# EasyEDA Pro project use0.1.eprj

# Schematic Schematic1
Board Name: Board1; Create Date: 2024-12-07; Page Name: P1; Project Name: use0.1; Schematic Name: Schematic1; Update Date: 2025-06-07; Add into BOM: yes; Company: 嘉立创EDA; Convert to PCB: yes; Page Size: A4; Version: V1.0
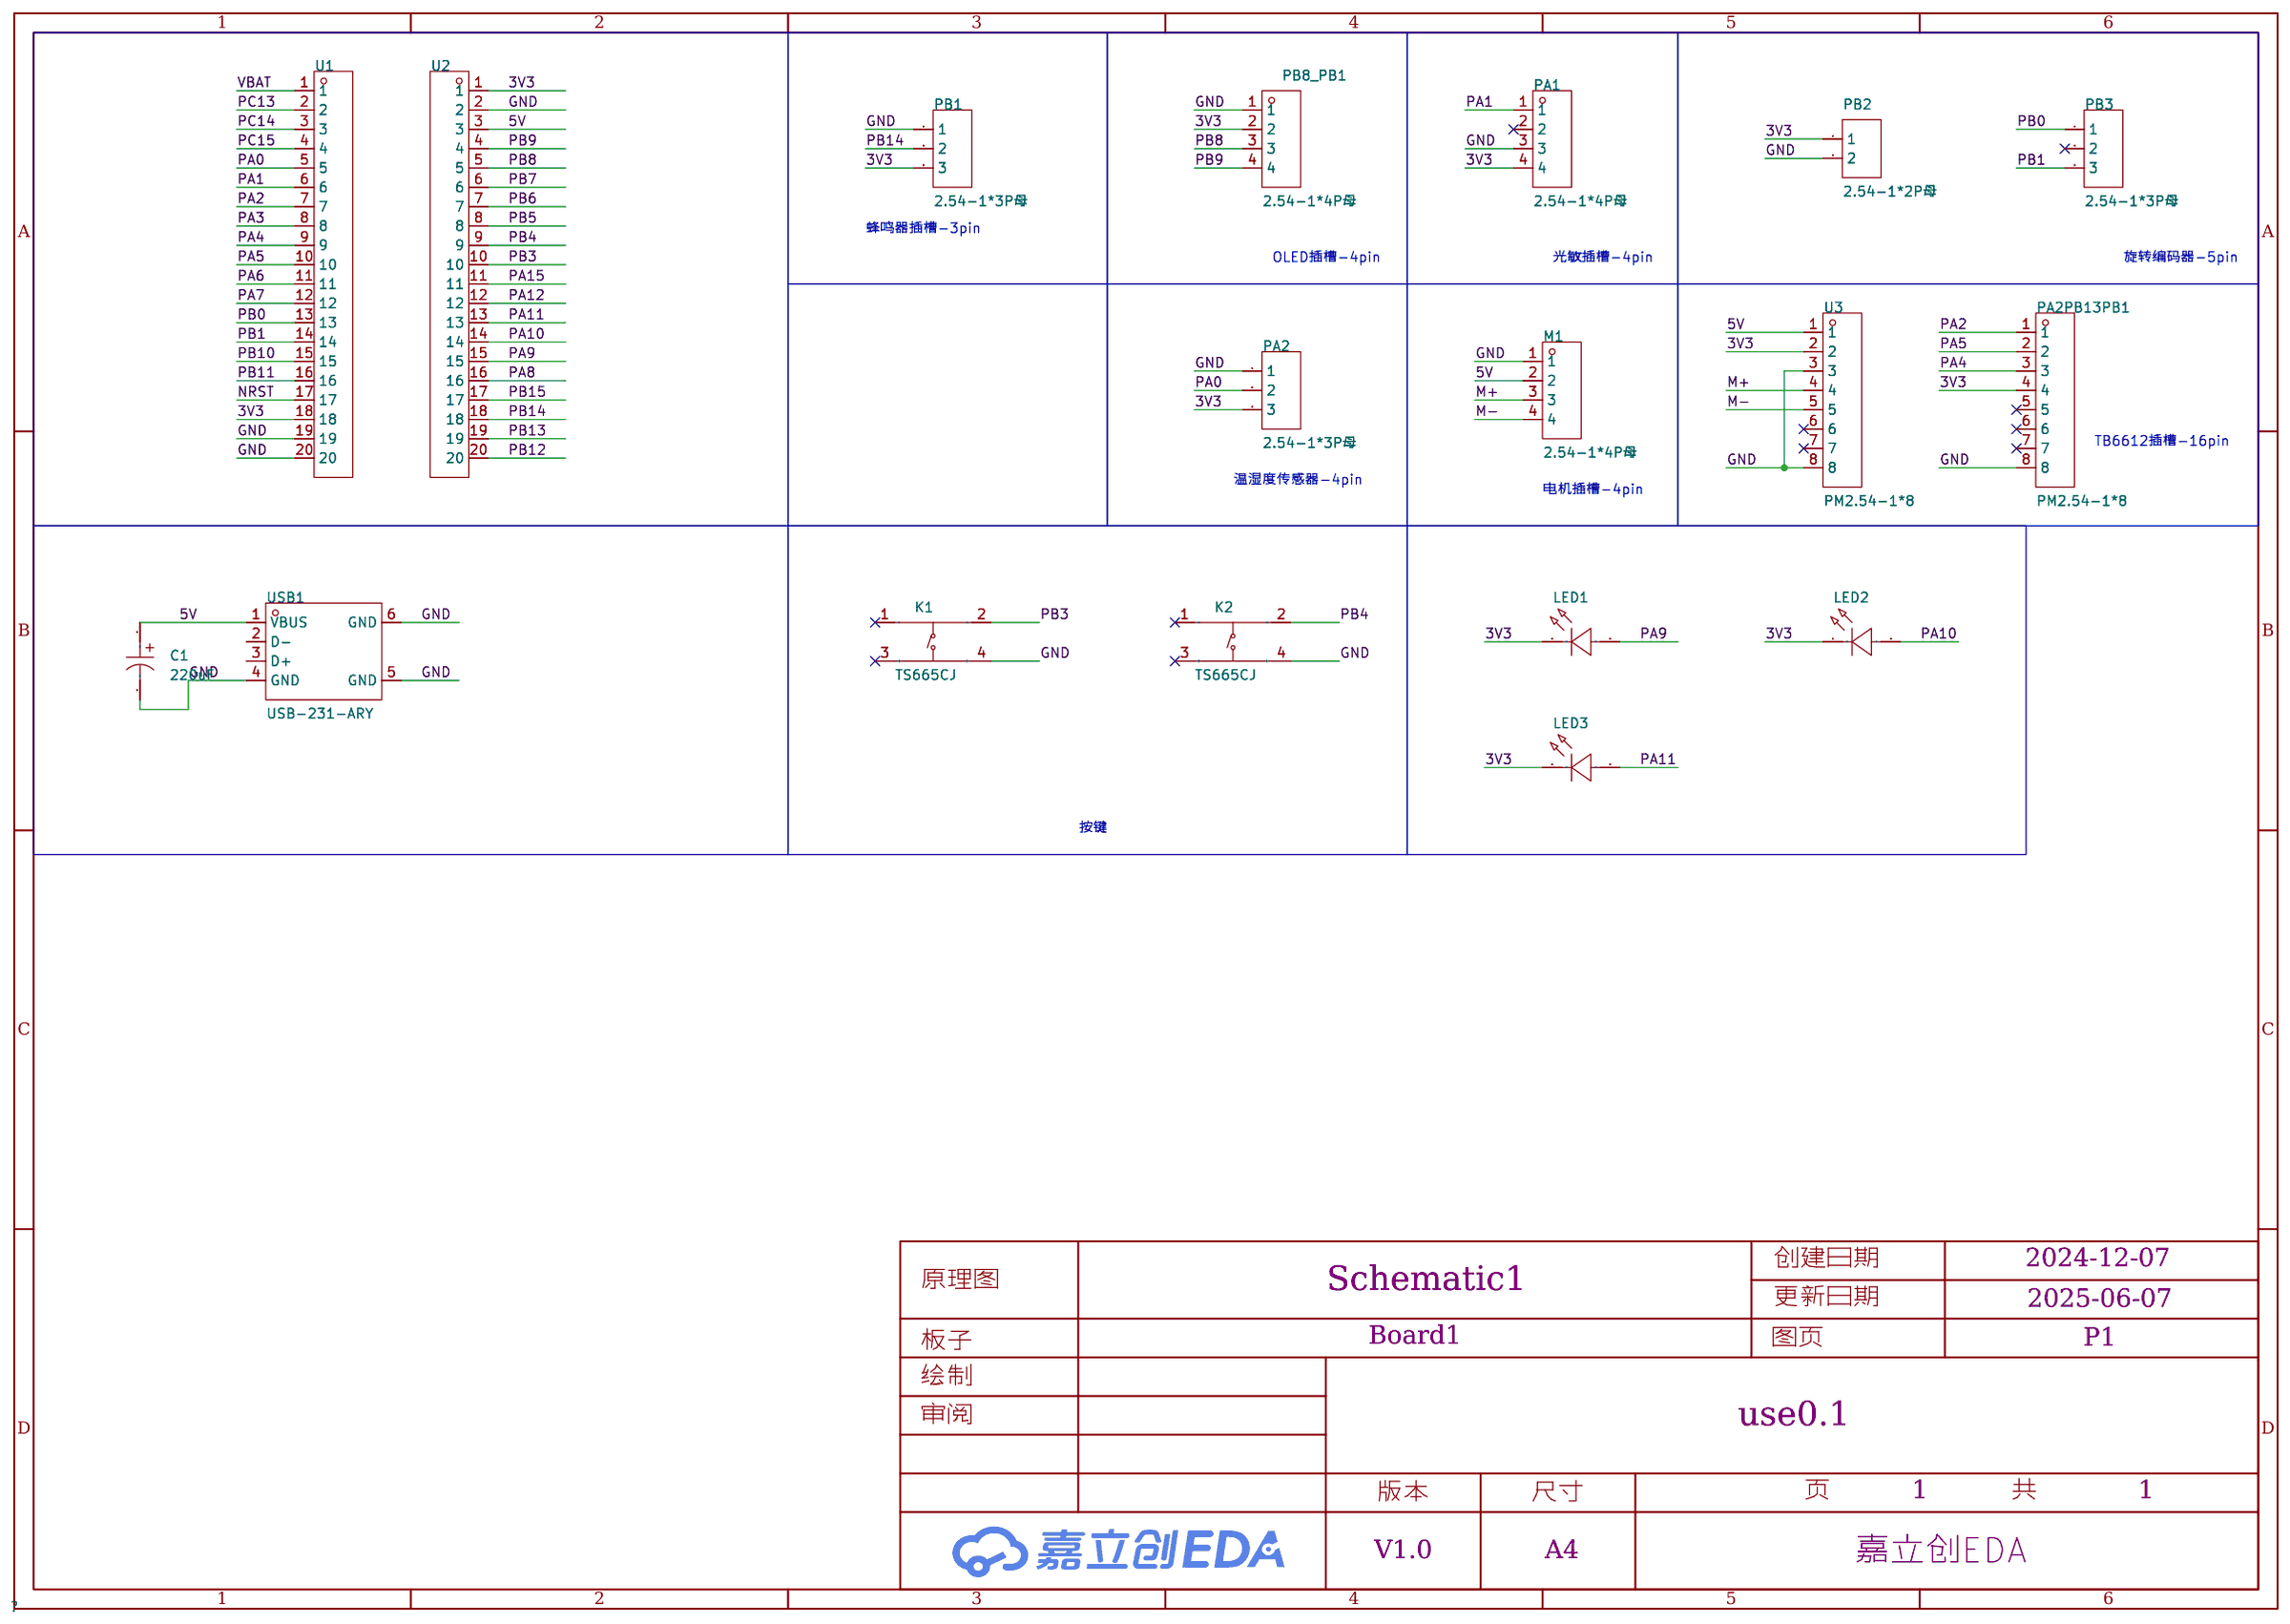
[diagram p0: schematic sheet]

## Parts
C1  220uF  [CAP-TH_BD5.0-P2.00-D0.5-FD]
K1  TS665CJ  [SW-TH_4P-L6.0-W6.0-P4.50-LS6.5]
K2  TS665CJ  [SW-TH_4P-L6.0-W6.0-P4.50-LS6.5]
LED1  NFD5408BC  [LED-TH_BD5.7-P2.54-RD]
LED2  NFD5408BC  [LED-TH_BD5.7-P2.54-RD]
LED3  NFD5408BC  [LED-TH_BD5.7-P2.54-RD]
M1  2.54-1*4P母  [HDR-TH_4P-P2.54-V-F]
PA1  2.54-1*4P母  [HDR-TH_4P-P2.54-V-F]
PA2  2.54-1*3P母  [HDR-TH_3P-P2.54-V-F]
PA2PB13PB1  PM2.54-1*8  [HDR-TH_8P-P2.54-V-F]
PB1  2.54-1*3P母  [HDR-TH_3P-P2.54-V-F]
PB2  2.54-1*2P母  [HDR-TH_2P-P2.54-V-F]
PB3  2.54-1*3P母  [HDR-TH_3P-P2.54-V-F]
PB8_PB1  2.54-1*4P母  [HDR-TH_4P-P2.54-V-F]
U1  KH-2.54FH-1X20P-H8.5  [HDR-TH_20P-P2.54-V-F-2]
U2  KH-2.54FH-1X20P-H8.5  [HDR-TH_20P-P2.54-V-F-2]
U3  PM2.54-1*8  [HDR-TH_8P-P2.54-V-F]
USB1  USB-231-ARY  [USB-A-TH_USB-231-ARY]

## Library data of the parts
C1 = ERA10V220M5X11: LCSC Part Name: 220uF ±20% 10V; Supplier Part: C49256786; Manufacturer: JIERR(捷而瑞); Supplier Footprint: 插件,D5xL11mm; JLCPCB Part Class: 扩展库; Datasheet: https://item.szlcsc.com/datasheet/ERA10V220M5X11/51692186.html; Supplier: LCSC; Tolerance: ±20%; Voltage Rating: 10V; Ripple Current: 170mA@120Hz; Pin Spacing: 2mm; Diameter: 5mm; Height - Seated (Max): 11mm; Lifetime: 2000hrs@105℃; Operating Temperature: -40℃~+105℃
K1 K2 = TS665CJ: 电路结构:单刀单掷;按钮形状:圆形按钮;安装方式:直插;开关长度:6mm;开关宽度:6mm;开关高度:5mm;触点电流:50mA;额定电压(DC):12V;带灯:-;机械寿命:-;; LCSC Part Name: 6*6*5mm 直插 轻触开关; Supplier Part: C393938; Manufacturer: SHOU HAN(首韩); Supplier Footprint: 插件; JLCPCB Part Class: 扩展库; Datasheet: https://atta.szlcsc.com/upload/public/pdf/source/20190521/C393938_BDABEAC600B4C55E200A80AA129B70BC.pdf; Supplier: LCSC; Circuit: 单刀单掷; Actuator Style: 圆形按钮; Mounting Style: 直插; Switch Length: 6mm; Switch Width: 6mm; Switch Height: 5mm; Contact Current: 50mA; Voltage Rating (DC): 12V
LED1-LED3 = NFD5408BC: LCSC Part Name: 发光二极管/LED; Supplier Part: C20618158; Manufacturer: 国星光电; Supplier Footprint: 插件,D=5mm; JLCPCB Part Class: 扩展库; Datasheet: https://atta.szlcsc.com/upload/public/pdf/source/20240202/FDA91858A41DA632758C1664CA47056B.pdf; Supplier: LCSC; Emitted Color: 蓝色; Power Dissipation: 200mW; Dominant Wavelength: 460nm~470nm; Viewing Angle: 20°; Operating Temperature: -30℃~+85℃
M1 PA1 PB8_PB1 = 2.54-1*4P母: 插孔结构:1x4P;间距:2.54mm;行距:-;圆孔/方孔:方孔;安装类型:直插;排数:单排;总孔位数:4P;额定电流:3A;额定电压:-;插孔方向:顶部;塑高:-;触头材质:青铜;触头镀层:-;工作温度范围:-40℃~+105℃;焊接温度(最大值):-;; LCSC Part Name: 间距:2.54mm 1x4P 直插; Supplier Part: C2718488; Manufacturer: BOOMELE(博穆精密); Supplier Footprint: 插件,P=2.54mm; JLCPCB Part Class: 扩展库; Datasheet: https://atta.szlcsc.com/upload/public/pdf/source/20210301/C2718488_F4427B881E42CAA8DDB0B1C12B3A522C.pdf; Supplier: LCSC; Holes Structure: 1x4P; Pitch: 2.54mm; Circular Hole / Square Hole: 方孔; Mounting Type: 直插; Number of Rows: 单排; Number of Holes: 4P; Current Rating (Max): 3A; Holes Direction: 顶部; Contact Material: 青铜; Operating Temperature Range: -40℃~+105℃
PA2 PB1 PB3 = 2.54-1*3P母: 间距:2.54mm;行距:-;安装类型:直插;排数:单排;总孔位数:3P;塑高:-;触头材质:-;触头镀层:金;; LCSC Part Name: 间距:2.54mm 直插; Supplier Part: C146243; Manufacturer: BOOMELE(博穆精密); Supplier Footprint: 插件,P=2.54mm; JLCPCB Part Class: 扩展库; Supplier: LCSC; Pitch: 2.54mm; Mounting Type: 直插; Number of Rows: 单排; Number of Holes: 3P; Contact Plating: 金
PA2PB13PB1 U3 = PM2.54-1*8: 插孔结构:1x8P;间距:2.54mm;行距:2.54mm;圆孔/方孔:方孔;安装类型:直插;排数:单排;总孔位数:8P;额定电流:2.5A;插孔方向:顶部;塑高:8.5mm;工作温度范围:-40℃~+105℃;; LCSC Part Name: 间距:2.54mm 1x8P 直插; Supplier Part: C5224027; Manufacturer: ZHOURI(洲日); Supplier Footprint: 插件,P=2.54mm; JLCPCB Part Class: 扩展库; Datasheet: https://atta.szlcsc.com/upload/public/pdf/source/20221031/E5BAE727A502DC7C69CE947E807E2296.pdf; Supplier: LCSC; Holes Structure: 1x8P; Pitch: 2.54mm; Row Spacing: 2.54mm; Circular Hole / Square Hole: 方孔; Mounting Type: 直插; Number of Rows: 单排; Number of Holes: 8P; Current Rating (Max): 2.5A; Holes Direction: 顶部; Insulation Height: 8.5mm; Operating Temperature Range: -40℃~+105℃
PB2 = 2.54-1*2P母: 插孔结构:1x2P;间距:2.54mm;行距:-;安装类型:直插;排数:单排;总孔位数:2P;塑高:-;触头材质:-;触头镀层:-;; LCSC Part Name: 间距:2.54mm 1x2P 直插; Supplier Part: C49661; Manufacturer: BOOMELE(博穆精密); Supplier Footprint: 插件,P=2.54mm; JLCPCB Part Class: 扩展库; Datasheet: https://atta.szlcsc.com/upload/public/pdf/source/20210301/C2718488_F4427B881E42CAA8DDB0B1C12B3A522C.pdf; Supplier: LCSC; Holes Structure: 1x2P; Pitch: 2.54mm; Mounting Type: 直插; Number of Rows: 单排; Number of Holes: 2P
U1 U2 = KH-2.54FH-1X20P-H8.5: 插孔结构:1x20P;间距:2.54mm;行距:-;圆孔/方孔:方孔;安装类型:直插;排数:单排;总孔位数:20P;额定电流:3A;额定电压:-;插孔方向:顶部;塑高:8.5mm;工作温度范围:-40℃~+105℃;; LCSC Part Name: 间距:2.54mm 1x20P 直插; Supplier Part: C2905423; Manufacturer: kinghelm(金航标); Supplier Footprint: 插件,P=2.54mm; JLCPCB Part Class: 扩展库; Datasheet: https://atta.szlcsc.com/upload/public/pdf/source/20211019/BDB673907948473CE61C8A1CF06C5BF5.pdf; Supplier: LCSC; Holes Structure: 1x20P; Pitch: 2.54mm; Circular Hole / Square Hole: 方孔; Mounting Type: 直插; Number of Rows: 单排; Number of Holes: 20P; Current Rating (Max): 3A; Holes Direction: 顶部; Insulation Height: 8.5mm; Operating Temperature Range: -40℃~+105℃
USB1 = USB-231-ARY: 连接器类型:Type-A;标准:USB 2.0;公母:母;端口数量:1;触点数量:4P;安装方式:弯插;额定电流 - 电源:1.5A;触头材质:-;触头镀层:-;工作温度范围:-20℃~+70℃;焊接温度(最大值):260℃;; LCSC Part Name: Type-A 母 弯插; Supplier Part: C720525; Manufacturer: XUNPU(讯普); Supplier Footprint: 插件; JLCPCB Part Class: 扩展库; Datasheet: https://atta.szlcsc.com/upload/public/pdf/source/20200810/C720525_A4C9C15D608FF9239C9C137FD959DB52.pdf; Supplier: LCSC; Connector Type: Type-A; Standard: USB 2.0; Gender: 母; Number of Ports: 1; Number of Contacts: 4P; Mounting Style: 弯插; Current Rating - Power (Max): 1.5A; Operating Temperature Range: -20℃~+70℃; Soldering Temperature(Max): 260℃

## Nets
3V3: LED1.1(K) LED2.1(K) LED3.1(K) PA1.4 PA2.3 PA2PB13PB1.4 PB1.3 PB2.1 PB8_PB1.2 U1.18 U2.1 U3.2
5V: C1.1 M1.2 U2.3 U3.1 USB1.1(VBUS)
GND: C1.2 K1.4(D) K2.4(D) M1.1 PA1.3 PA2.1 PA2PB13PB1.8 PB1.1 PB2.2 PB8_PB1.1 U1.19 U1.20 U2.2 U3.3 U3.8 USB1.4(GND) USB1.5(GND) USB1.6(GND)
VBAT: U1.1
M+: M1.3 U3.4
M-: M1.4 U3.5
NRST: U1.17
PA0: PA2.2 U1.5
PA1: PA1.1 U1.6
PA2: PA2PB13PB1.1 U1.7
PA3: U1.8
PA4: PA2PB13PB1.3 U1.9
PA5: PA2PB13PB1.2 U1.10
PA6: U1.11
PA7: U1.12
PA8: U2.16
PA9: LED1.2(A) U2.15
PA10: LED2.2(A) U2.14
PA11: LED3.2(A) U2.13
PA12: U2.12
PA15: U2.11
PB0: PB3.1 U1.13
PB1: PB3.3 U1.14
PB3: K1.2(B) U2.10
PB4: K2.2(B) U2.9
PB5: U2.8
PB6: U2.7
PB7: U2.6
PB8: PB8_PB1.3 U2.5
PB9: PB8_PB1.4 U2.4
PB10: U1.15
PB11: U1.16
PB12: U2.20
PB13: U2.19
PB14: PB1.2 U2.18
PB15: U2.17
PC13: U1.2
PC14: U1.3
PC15: U1.4

Not connected (* = marked no-connect by the designer): K1 1(A)* 3(C)*; K2 1(A)* 3(C)*; PA1 2*; PA2PB13PB1 5* 6* 7*; PB3 2*; U3 6* 7*; USB1 2(D-) 3(D+)

## Notes on the sheet
- 蜂鸣器插槽-3pin
- OLED插槽-4pin
- 光敏插槽-4pin
- 旋转编码器-5pin
- TB6612插槽-16pin
- 温湿度传感器-4pin
- 电机插槽-4pin
- 按键

# Board PCB2
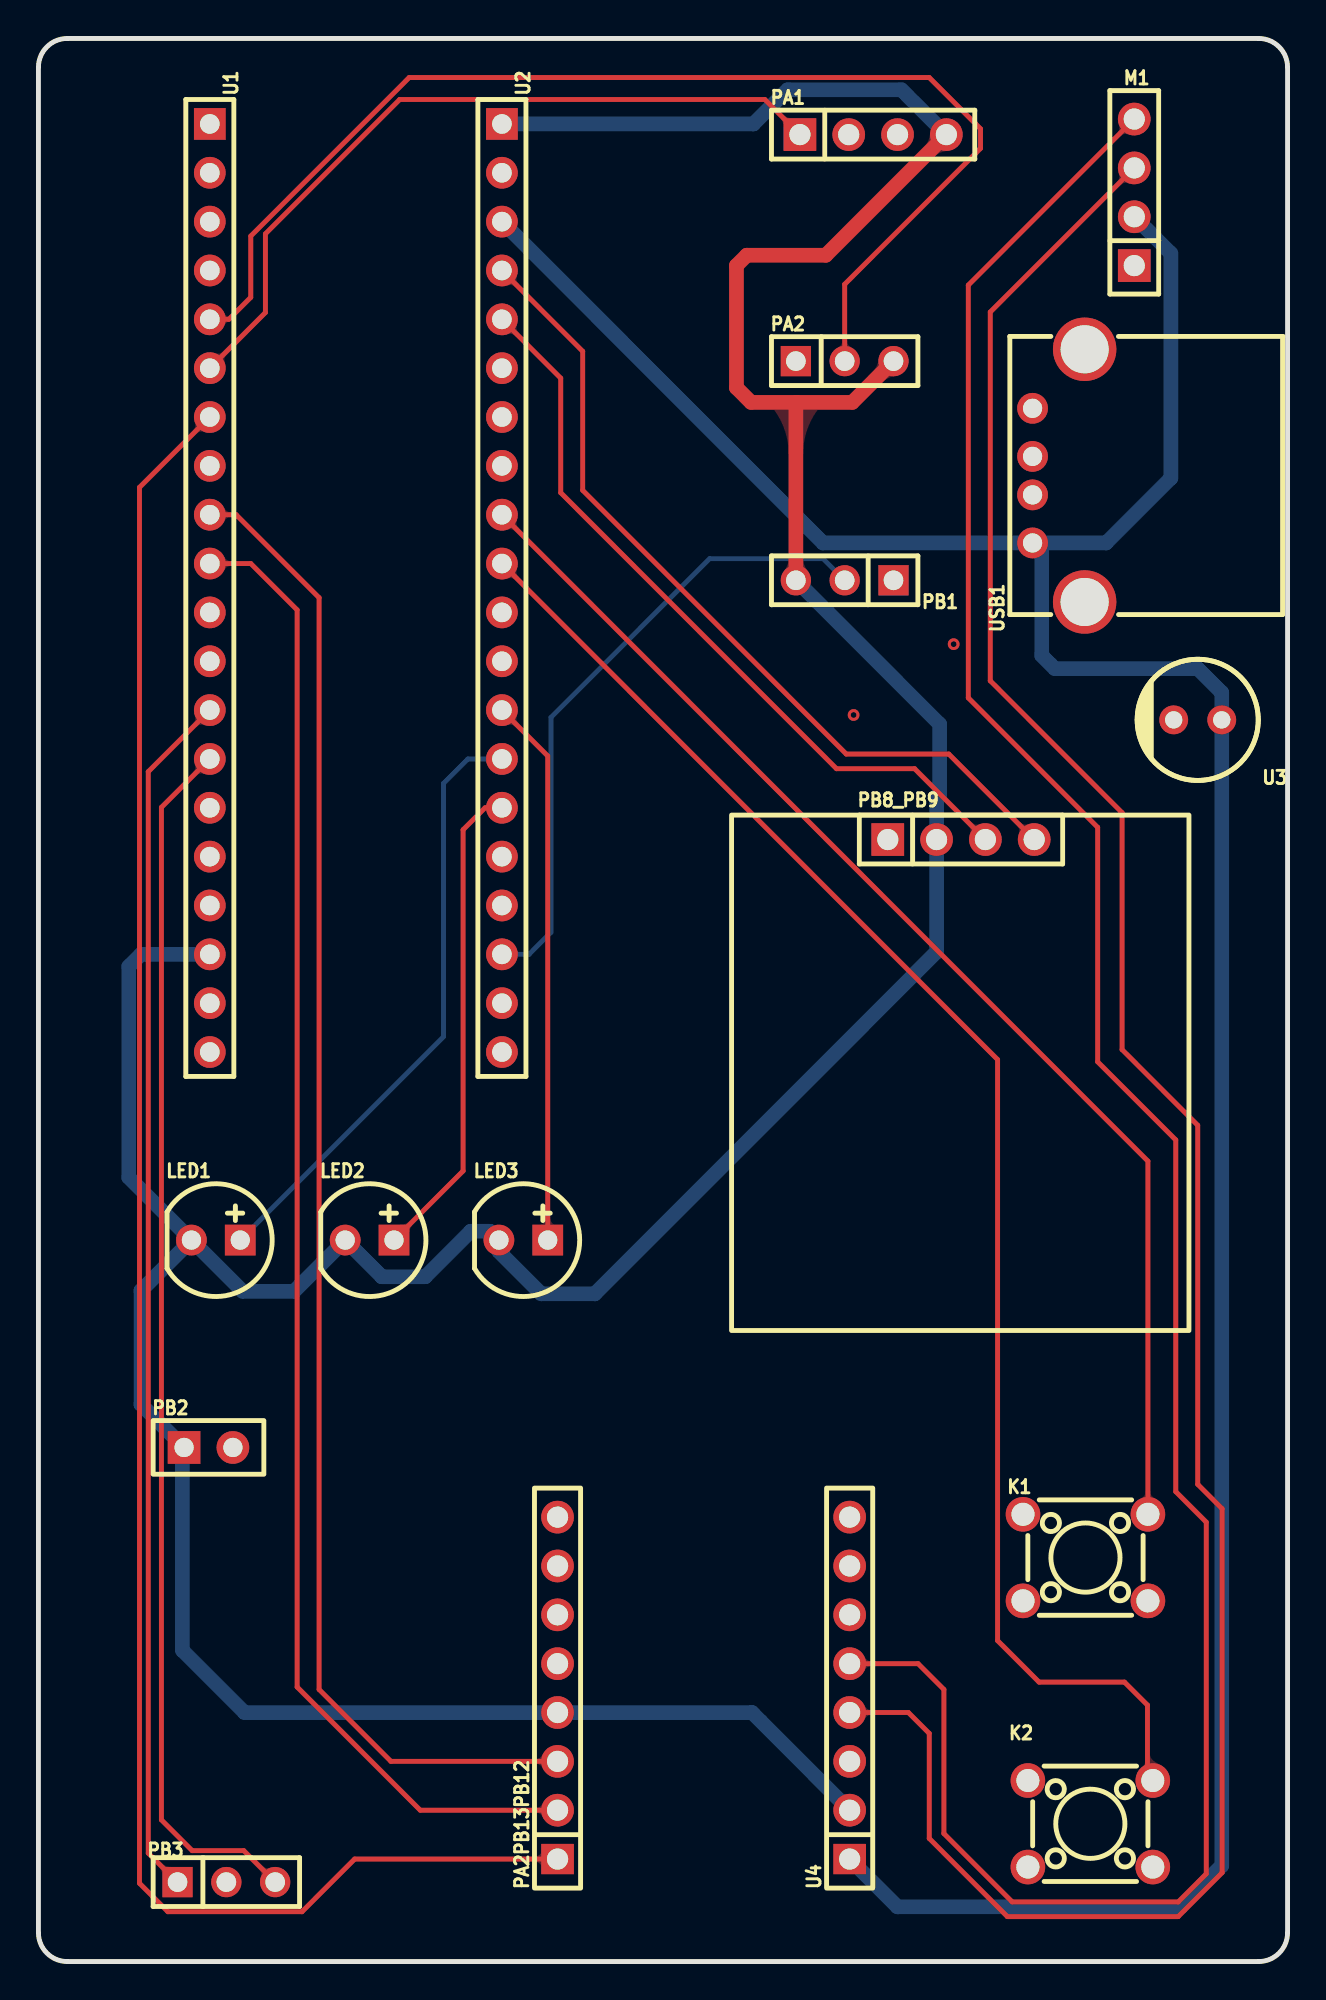
[diagram p1: board, top side]
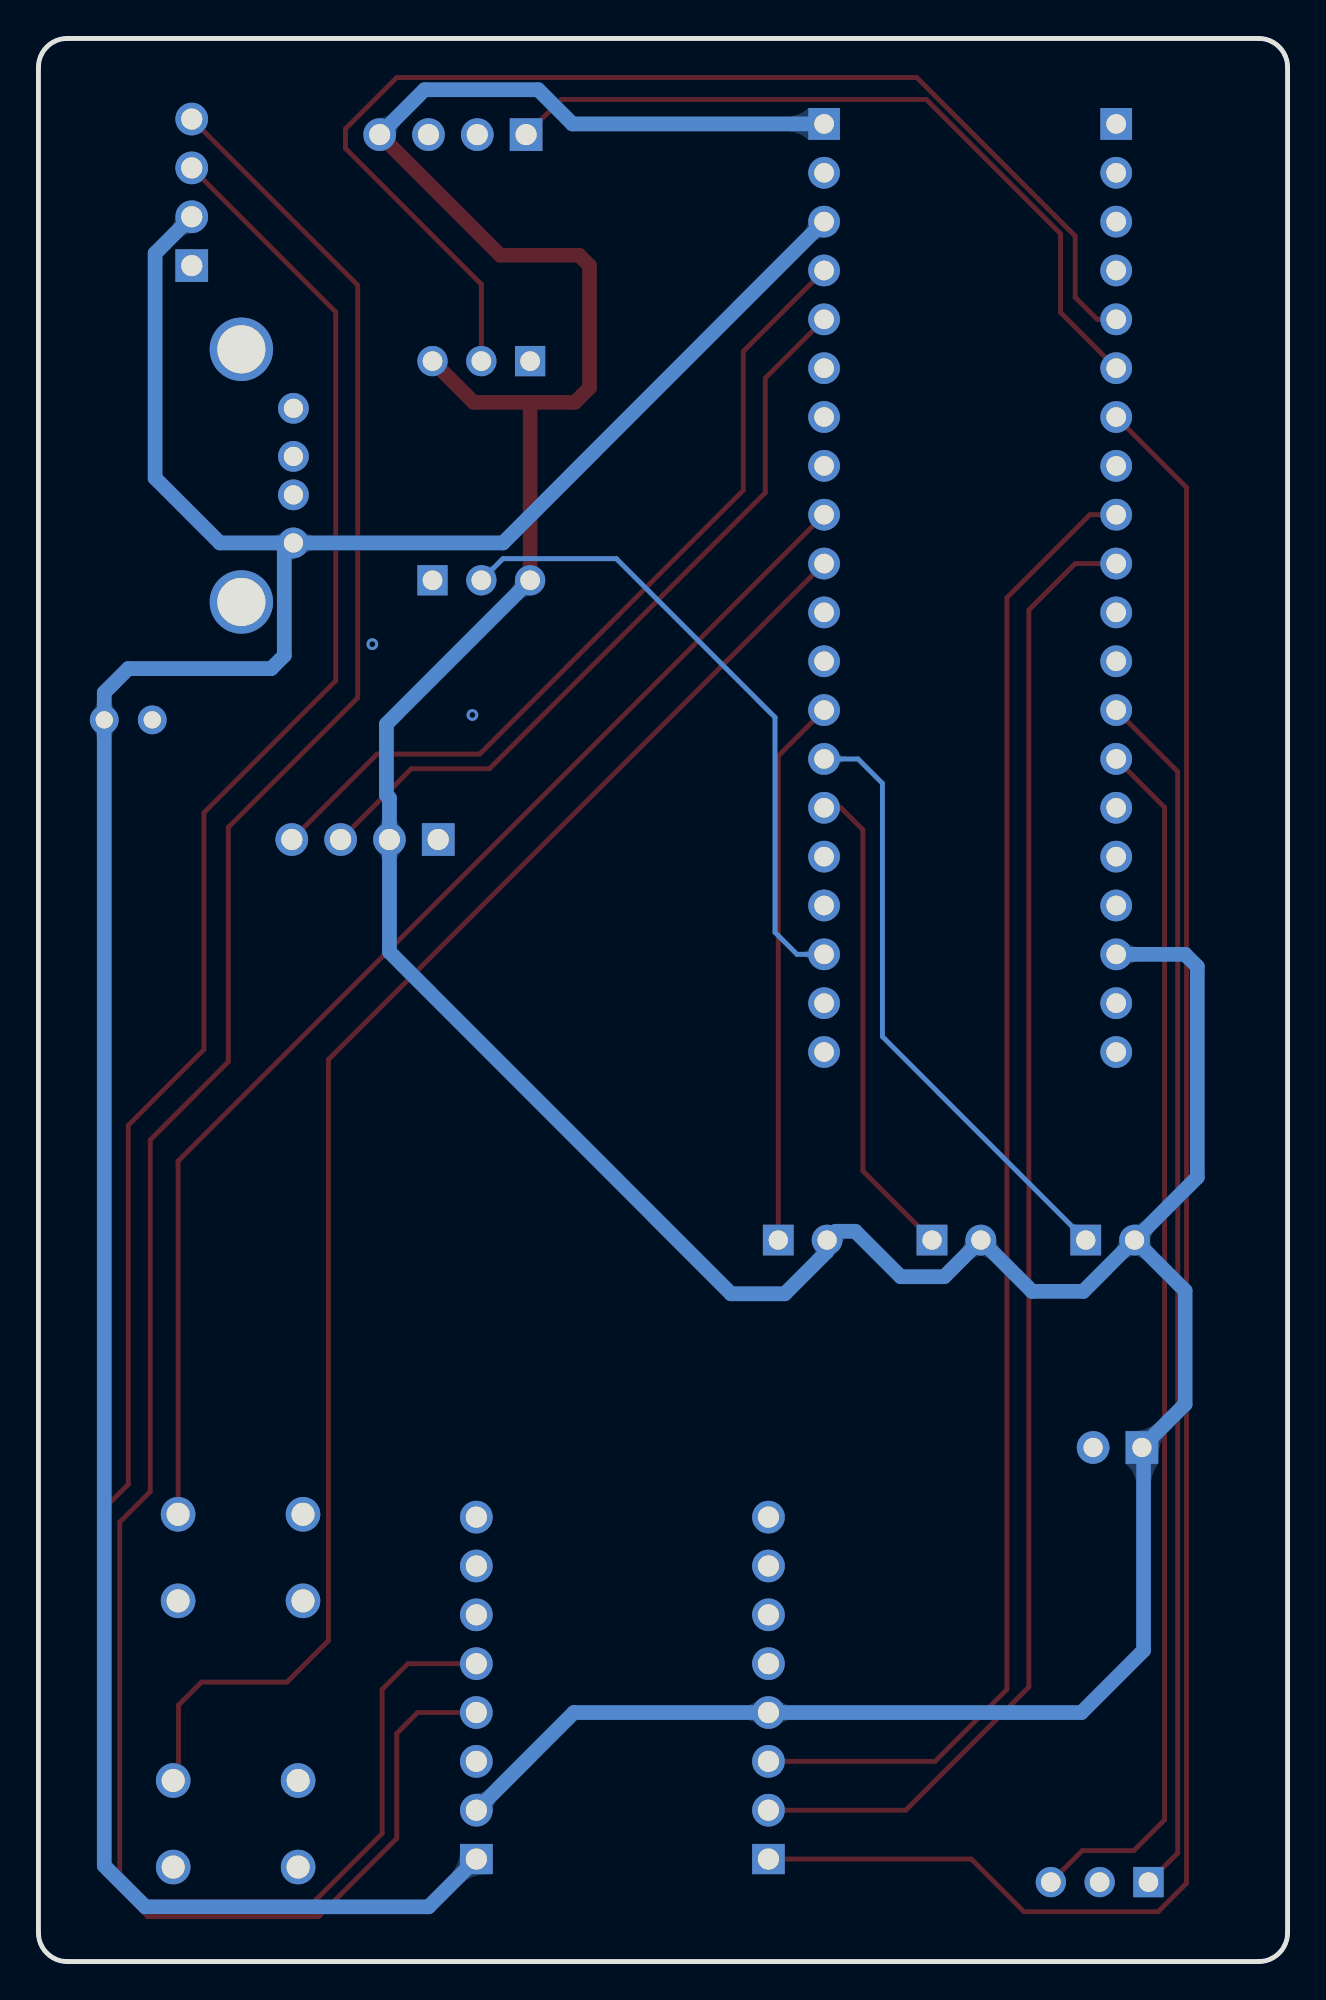
[diagram p2: board, bottom side, seen from below]

Outline 65 x 100 mm; copper layers: Top Layer, Bottom Layer. Coordinates in mm from the lower left corner of the outline.
Outline path: 0,98.5 0,1.5 arc(0.44,0.44) 1.5,0 63.5,0 arc(64.56,0.44) 65,1.5 65,98.5 arc(64.56,99.56) 63.5,100 1.5,100 arc(0.44,99.56) 0,98.5
Stack: Top Layer 0.035mm / Dielectric1 1.51mm FR4 er 4.5 / Bottom Layer 0.035mm

## Design rules (mm)
template: my pcb
spacing copperThickness1oz (default): track to track 0.203, other pairs 0.203 to 0.203
track width copperThickness1oz (default): min 0.254, default 0.254, max 0.762
track width VCC and  GND: min 0.254, default 0.762, max 0.762
differential pair differentialPair (default): width min 0.127, default 0.254, max 2.54; gap min 0.152, default 0.152
via viaSize (default): diameter min 0.5, default 0.61, max 10; hole min 0.3, default 0.305, max 6.299
net GND uses VCC and  GND
net 3V3 uses VCC and  GND
net 5V uses VCC and  GND

## Placement (name value [footprint] x y rotation side)
K1  TS665CJ  [SW-TH_4P-L6.0-W6.0-P4.50-LS6.5]  54.48 21.01 0 top
K2  TS665CJ  [SW-TH_4P-L6.0-W6.0-P4.50-LS6.5]  54.74 7.16 0 top
LED1  NFD5408BC  [LED-TH_BD5.7-P2.54-RD]  9.23 37.52 0 top
LED2  NFD5408BC  [LED-TH_BD5.7-P2.54-RD]  17.23 37.52 0 top
LED3  NFD5408BC  [LED-TH_BD5.7-P2.54-RD]  25.23 37.52 0 top
M1  2.54-1*4P母  [HDR-TH_4P-P2.54-V-F]  57.02 92 90 top
PA1  2.54-1*4P母  [HDR-TH_4P-P2.54-V-F]  43.43 95 0 top
PA2  2.54-1*3P母  [HDR-TH_3P-P2.54-V-F]  41.95 83.22 0 top
PA2PB13PB12  PM2.54-1*8  [HDR-TH_8P-P2.54-V-F]  27.01 14.22 90 top
PB1  2.54-1*3P母  [HDR-TH_3P-P2.54-V-F]  41.95 71.83 180 top
PB2  2.54-1*2P母  [HDR-TH_2P-P2.54-V-F]  8.85 26.73 0 top
PB3  2.54-1*3P母  [HDR-TH_3P-P2.54-V-F]  9.78 4.13 0 top
PB8_PB9  2.54-1*4P母  [HDR-TH_4P-P2.54-V-F]  48.01 58.34 0 top
U1  KH-2.54FH-1X20P-H8.5  [HDR-TH_20P-P2.54-V-F-2]  8.92 71.42 270 top
U2  KH-2.54FH-1X20P-H8.5  [HDR-TH_20P-P2.54-V-F-2]  24.12 71.42 270 top
U3  PM2.54-1*8  [CAP-TH_BD6.3-P2.50-D0.5-FD]  60.32 64.57 180 top
U4  PM2.54-1*8  [HDR-TH_8P-P2.54-V-F]  42.21 14.22 90 top
USB1  USB-231-ARY  [USB-A-TH_USB-231-ARY]  53.09 77.27 90 top

## Footprints (pads in the part's own frame, mm; a bottom-side part is the same pattern mirrored in y, then rotated)
CAP-TH_BD6.3-P2.50-D0.5-FD
  round 1.5 hole 0.9: 1(-1.25,0) 2(1.25,0)
HDR-TH_2P-P2.54-V-F
  rect 1.7x1.7 hole 1: 1(-1.27,0)
  round 1.7 hole 1: 2(1.27,0)
HDR-TH_3P-P2.54-V-F
  rect 1.575x1.575 hole 1.02: 1(-2.54,0)
  round 1.575 hole 1.02: 2(0,0) 3(2.54,0)
HDR-TH_4P-P2.54-V-F
  rect 1.7x1.7 hole 1.1: 1(-3.81,0)
  round 1.7 hole 1.1: 2(-1.27,0) 3(1.27,0) 4(3.81,0)
HDR-TH_8P-P2.54-V-F
  rect 1.575x1.7 hole 1.1: 1(-8.89,0)
  round 1.7 hole 1.1: 2(-6.35,0) 3(-3.81,0) 4(-1.27,0) 5(1.27,0) 6(3.81,0) 7(6.35,0) 8(8.89,0)
HDR-TH_20P-P2.54-V-F-2
  rect 1.65x1.65 hole 1.02: 1(-24.13,0)
  round 1.65 hole 1.02: 2(-21.59,0) 3(-19.05,0) 4(-16.51,0) 5(-13.97,0) 6(-11.43,0) 7(-8.89,0) 8(-6.35,0) 9(-3.81,0) 10(-1.27,0) 11(1.27,0) 12(3.81,0) 13(6.35,0) 14(8.89,0) 15(11.43,0) 16(13.97,0) 17(16.51,0) 18(19.05,0) 19(21.59,0) 20(24.13,0)
LED-TH_BD5.7-P2.54-RD
  round 1.6 hole 1: 1(-1.27,0)
  rect 1.6x1.6 hole 1: 2(1.27,0)
SW-TH_4P-L6.0-W6.0-P4.50-LS6.5
  round 1.8 hole 1.2: 1(-3.25,2.25) 2(3.25,2.25) 3(-3.25,-2.25) 4(3.25,-2.25)
USB-A-TH_USB-231-ARY
  round 1.6 hole 1: 1(-3.5,1.355) 2(-1,1.355) 3(1,1.355) 4(3.5,1.355)
  round 3.3 hole 2.5: 5(-6.57,-1.355) 6(6.57,-1.355)

## Nets
3V3: LED1.1 LED2.1 LED3.1 PA1.4 PA2.3 PA2PB13PB12.4 PB1.3 PB2.1 PB8_PB9.2 U1.18 U2.1 U4.2
5V: M1.2 U2.3 U3.1 U4.1 USB1.1
GND: K1.4 K2.4 M1.1 PA1.3 PA2.1 PA2PB13PB12.8 PB1.1 PB2.2 PB8_PB9.1 U1.19 U1.20 U2.2 U3.2 U4.3 U4.8 USB1.4
VBAT: U1.1
M+: M1.3 U4.4
M-: M1.4 U4.5
NRST: U1.17
PA0: PA2.2 U1.5
PA1: PA1.1 U1.6
PA2: PA2PB13PB12.1 U1.7
PA3: U1.8
PA4: PA2PB13PB12.3 U1.9
PA5: PA2PB13PB12.2 U1.10
PA6: U1.11
PA7: U1.12
PA8: U2.16
PA9: LED2.2 U2.15
PA10: LED1.2 U2.14
PA11: LED3.2 U2.13
PA12: U2.12
PA15: U2.11
PB0: PB3.1 U1.13
PB1: PB3.3 U1.14
PB3: K2.2 U2.10
PB4: K1.2 U2.9
PB5: U2.8
PB6: U2.7
PB7: U2.6
PB8: PB8_PB9.3 U2.5
PB9: PB8_PB9.4 U2.4
PB10: U1.15
PB11: U1.16
PB12: U2.20
PB13: U2.19
PB14: PB1.2 U2.18
PB15: U2.17
PC13: U1.2
PC14: U1.3
PC15: U1.4

Pads without a net: K1 1 3; K2 1 3; PA1 2; PA2PB13PB12 5 6 7; PB3 2; U4 6 7; USB1 2 3 5 6

## Via types
v1: diameter 0.61, hole 0.305, Top Layer to Bottom Layer, 2 vias

## Routing (per net, layer and track width the routed paths; a pad name or vN(x,y) marks a point on that pad's centre or on a via; arc(x,y) is an arc through that point)
3V3: length 219.5
  Top Layer w0.762: PA2.3 42.35,81.08 39.45,81.08 ; PA1.4 40.97,88.73 36.86,88.73 36.32,88.19 36.32,81.84 37.08,81.08 39.45,81.08 ; 39.45,81.08 39.41,81.04 PB1.3
  Bottom Layer w0.762: U4.2 37.13,12.95 PA2PB13PB12.4 10.72,12.95 7.49,16.18 7.49,26.65 PB2.1 5.33,28.98 5.33,34.89 LED1.1 ; U1.18 5.33,52.38 4.7,51.74 4.7,40.78 LED1.1 ; LED1.1 10.63,34.85 13.29,34.85 LED2.1 17.87,35.61 20.13,35.61 22.49,37.97 23.5,37.97 LED3.1 23.96,36.92 26.16,34.72 28.96,34.72 46.74,52.5 PB8_PB9.2 46.74,60.5 46.89,60.66 46.89,64.34 PB1.3 ; PA1.4 44.91,97.33 38.99,97.33 37.21,95.56 24.12,95.56
5V: length 156
  Bottom Layer w0.762: USB1.1 55.56,73.77 58.93,77.14 58.93,88.82 M1.2 ; USB1.1 52.21,73.29 52.21,67.91 52.89,67.23 60.32,67.23 61.57,65.98 U3.1 61.57,4.98 59.44,2.84 44.7,2.84 U4.1 ; USB1.1 40.83,73.77 U2.3
GND:
  vias: v1(42.42,64.82) v1(47.62,68.5)
M+: length 124.7
  Top Layer w0.254: U4.4 45.27,12.95 46.35,11.86 46.35,6.4 50.42,2.34 59.31,2.34 61.59,4.62 61.59,23.55 60.32,24.82 60.32,43.48 56.39,47.42 56.39,59.74 49.53,66.6 49.53,85.78 M1.3
M-: length 128.6
  Top Layer w0.254: M1.4 48.39,87.17 48.39,65.71 55.12,58.98 55.12,46.79 59.18,42.72 59.18,24.44 60.77,22.85 60.77,4.56 59.31,3.1 50.67,3.1 47.12,6.66 47.12,14.15 45.78,15.49 U4.5
PA0: length 63.3
  Top Layer w0.254: U1.5 9.91,85.39 11.05,86.54 11.05,89.72 19.29,97.97 46.35,97.97 49.02,95.3 49.02,94.28 41.95,87.22 PA2.2
PA1: length 39.6
  Top Layer w0.254: PA1.1 37.8,96.83 18.8,96.83 11.81,89.84 11.81,85.75 8.92,82.86
PA2: length 101.3
  Top Layer w0.254: PA2PB13PB12.1 16.45,5.33 13.72,2.59 6.74,2.59 5.26,4.07 5.26,76.66 U1.7
PA4: length 78.2
  Top Layer w0.254: PA2PB13PB12.3 18.34,10.41 14.6,14.15 14.6,70.92 10.29,75.23 U1.9
PA5: length 77.8
  Top Layer w0.254: PA2PB13PB12.2 19.87,7.87 13.46,14.28 13.46,70.28 11.05,72.69 U1.10
PA9: length 25.3
  Top Layer w0.254: LED2.2 22.1,41.11 22.1,58.85 23.24,60 U2.15
PA10: length 31.7
  Bottom Layer w0.254: LED1.2 21.08,48.1 21.08,61.27 22.35,62.53 U2.14
PA11: length 28.5
  Top Layer w0.254: U2.13 26.5,62.69 LED3.2
PB0: length 62.9
  Top Layer w0.254: U1.13 5.72,61.87 5.72,5.64 7.22,4.13 7.24,4.13
PB1: length 63.5
  Top Layer w0.254: PB3.3 10.68,5.77 8,5.77 6.4,7.37 6.4,60.02 U1.14
PB3: length 79.9
  Top Layer w0.254: U2.10 49.91,46.9 49.91,16.69 52.07,14.53 56.51,14.53 57.71,13.33 57.71,9.69 K2.2
PB4: length 65.9
  Top Layer w0.254: U2.9 57.73,41.62 K1.2
PB8: length 39.9
  Top Layer w0.254: U2.5 27.18,82.33 27.18,76.38 41.53,62.03 45.59,62.03 PB8_PB9.3
PB9: length 44.2
  Top Layer w0.254: U2.4 28.32,83.73 28.32,76.5 42.04,62.79 47.37,62.79 PB8_PB9.4
PB14: length 33.4
  Bottom Layer w0.254: PB1.2 40.83,72.95 34.93,72.95 26.67,64.69 26.67,53.52 25.53,52.38 U2.18

Small or netless copper shapes (teardrops, artwork), in the pictures only: 34 on Top Layer, 30 on Bottom Layer
